# Altium project QUTMS_PDM_V2.PrjPcb
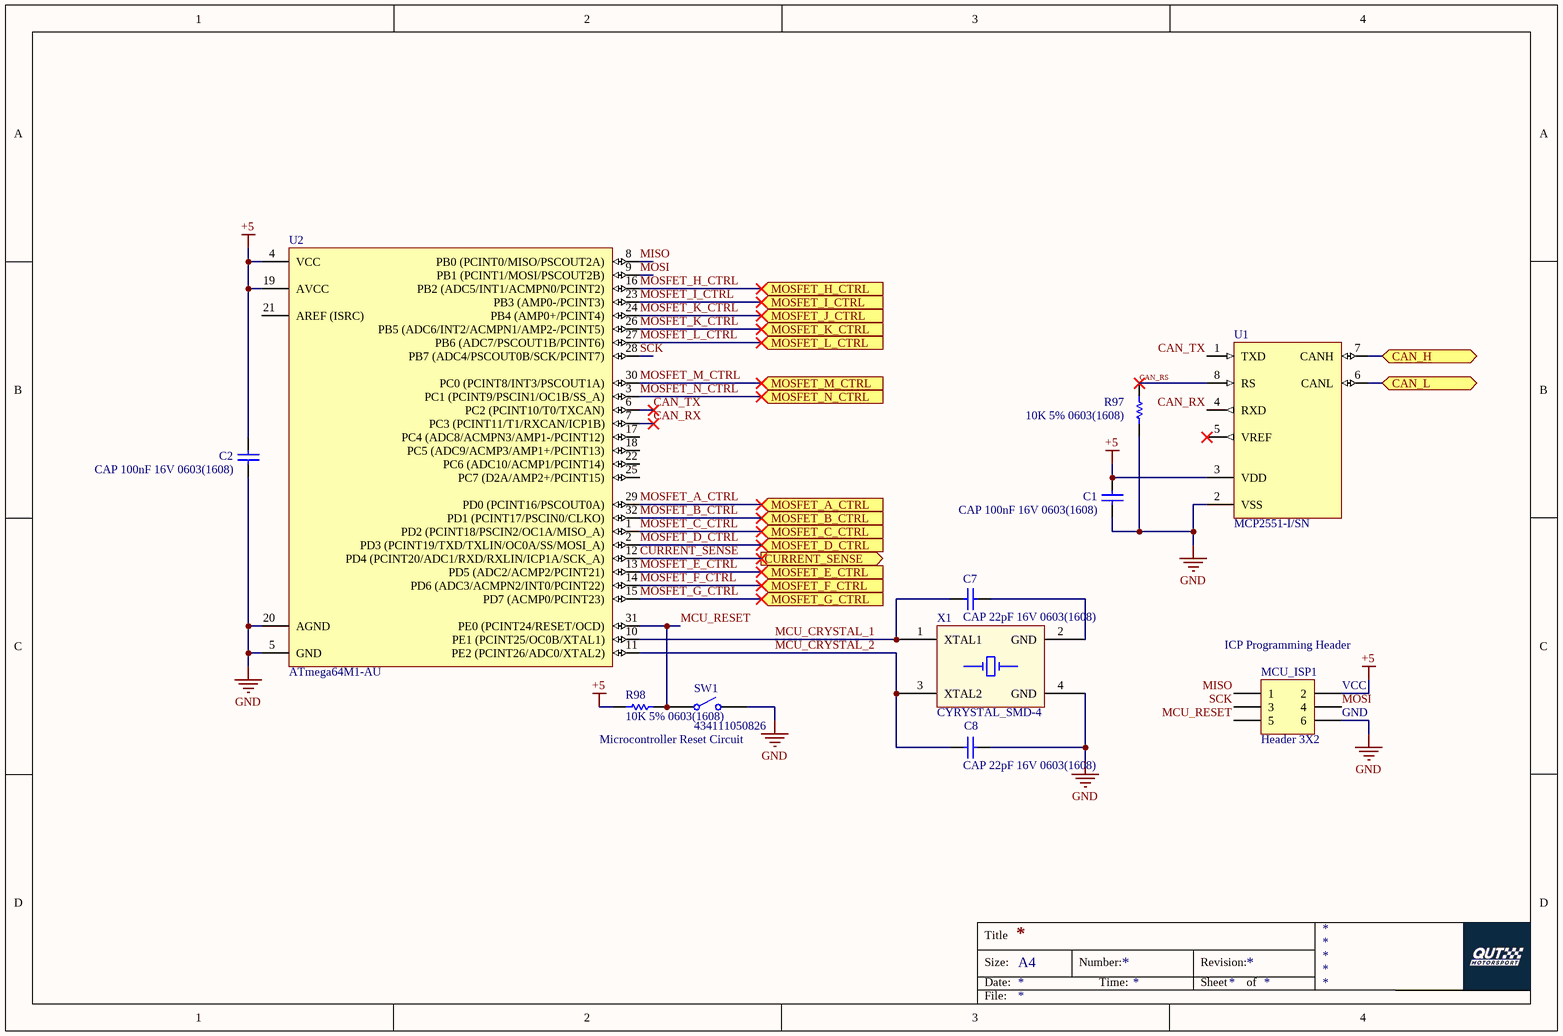
[diagram p0: MCU.SchDoc]
5 sheets, 96 parts. Net scope: flat (ports and power ports of the same name join across sheets).
Board file: Board.PcbDoc
Sheets:
  MCU.SchDoc
  ConnectorIn.SchDoc
  ConnectorOut.SchDoc
  PowerSupply.SchDoc
  MOSFETs.SchDoc

## Sheet MCU.SchDoc
size A4

### Parts
C1  CAP 100nF 16V 0603(1608)  [CAPC0603(1608)100_M]
C2  CAP 100nF 16V 0603(1608)  [CAPC0603(1608)100_M]
C7  CAP 22pF 16V 0603(1608)  [CAPC0603(1608)100_N]
C8  CAP 22pF 16V 0603(1608)  [CAPC0603(1608)100_N]
MCU_ISP1  Header 3X2  [HDR2X3]
R97  10K 5% 0603(1608)  [RESC0603(1608)_N]
R98  10K 5% 0603(1608)  [RESC0603(1608)_N]
SW1  434111050826  [434111050826]
U1  MCP2551-I/SN  [SOIC-SN8_N]
U2  ATmega64M1-AU  [32A_L]
X1  CYRYSTAL_SMD-4  [SMD-4_CRYSTAL_5x3.2mm]

### Ports
CAN_H (bidir), CAN_L (bidir), CURRENT_SENSE (out), MOSFET_A_CTRL (in), MOSFET_B_CTRL (in), MOSFET_C_CTRL (in), MOSFET_D_CTRL (in), MOSFET_E_CTRL (in), MOSFET_F_CTRL (in), MOSFET_G_CTRL (in), MOSFET_H_CTRL (in), MOSFET_I_CTRL (in), MOSFET_J_CTRL (in), MOSFET_K_CTRL (in), MOSFET_L_CTRL (in), MOSFET_M_CTRL (in), MOSFET_N_CTRL (in)

### Nets
+5: C1.2 C2.2 MCU_ISP1.2 R98.2 U1.3(VDD) U2.4(VCC) U2.19(AVCC)
GND: C1.1 C2.1 C8.2 MCU_ISP1.6 R97.1 SW1.2 U1.2(VSS) U2.5(GND) U2.20(AGND) X1.4(GND)
CAN_RS: R97.2 U1.8(RS)
CAN_RX: U1.4(RXD) U2.7(PC3_(PCINT11/T1/RXCAN/ICP1B))
CAN_TX: U1.1(TXD) U2.6(PC2_(PCINT10/T0/TXCAN))
CURRENT_SENSE: U2.12(PD4_(PCINT20/ADC1/RXD/RXLIN/ICP1A/SCK_A)) ; port CURRENT_SENSE
MCU_CRYSTAL_1: C7.1 U2.10(PE1_(PCINT25/OC0B/XTAL1)) X1.1(XTAL1)
MCU_CRYSTAL_2: C8.1 U2.11(PE2_(PCINT26/ADC0/XTAL2)) X1.3(XTAL2)
MCU_RESET: MCU_ISP1.5 R98.1 SW1.1 U2.31(PE0_(PCINT24/RESET/OCD))
MISO: MCU_ISP1.1 U2.8(PB0_(PCINT0/MISO/PSCOUT2A))
MOSFET_A_CTRL: U2.29(PD0_(PCINT16/PSCOUT0A)) ; port MOSFET_A_CTRL
MOSFET_B_CTRL: U2.32(PD1_(PCINT17/PSCIN0/CLKO)) ; port MOSFET_B_CTRL
MOSFET_C_CTRL: U2.1(PD2_(PCINT18/PSCIN2/OC1A/MISO_A)) ; port MOSFET_C_CTRL
MOSFET_D_CTRL: U2.2(PD3_(PCINT19/TXD/TXLIN/OC0A/SS/MOSI_A)) ; port MOSFET_D_CTRL
MOSFET_E_CTRL: U2.13(PD5_(ADC2/ACMP2/PCINT21)) ; port MOSFET_E_CTRL
MOSFET_F_CTRL: U2.14(PD6_(ADC3/ACMPN2/INT0/PCINT22)) ; port MOSFET_F_CTRL
MOSFET_G_CTRL: U2.15(PD7_(ACMP0/PCINT23)) ; port MOSFET_G_CTRL
MOSFET_H_CTRL: U2.16(PB2_(ADC5/INT1/ACMPN0/PCINT2)) ; port MOSFET_H_CTRL
MOSFET_I_CTRL: U2.23(PB3_(AMP0-/PCINT3)) ; port MOSFET_I_CTRL
MOSFET_K_CTRL: U2.24(PB4_(AMP0+/PCINT4)) U2.26(PB5_(ADC6/INT2/ACMPN1/AMP2-/PCINT5)) ; port MOSFET_J_CTRL, port MOSFET_K_CTRL
MOSFET_L_CTRL: U2.27(PB6_(ADC7/PSCOUT1B/PCINT6)) ; port MOSFET_L_CTRL
MOSFET_M_CTRL: U2.30(PC0_(PCINT8/INT3/PSCOUT1A)) ; port MOSFET_M_CTRL
MOSFET_N_CTRL: U2.3(PC1_(PCINT9/PSCIN1/OC1B/SS_A)) ; port MOSFET_N_CTRL
MOSI: MCU_ISP1.4 U2.9(PB1_(PCINT1/MOSI/PSCOUT2B))
SCK: MCU_ISP1.3 U2.28(PB7_(ADC4/PSCOUT0B/SCK/PCINT7))
NetC7_2: C7.2 X1.2(GND)
NetJ1_2: U1.6(CANL) ; port CAN_L
NetJ1_3: U1.7(CANH) ; port CAN_H

Not connected (* = marked no-connect by the designer): U1 5(VREF)*; U2 17(PC4_(ADC8/ACMPN3/AMP1-/PCINT12)) 18(PC5_(ADC9/ACMP3/AMP1+/PCINT13)) 21(AREF_(ISRC)) 22(PC6_(ADC10/ACMP1/PCINT14)) 25(PC7_(D2A/AMP2+/PCINT15))

### Notes on the sheet
- (near MCU_ISP1) ICP Programming Header
- (near MCU_ISP1) VCC
- (near MCU_ISP1) GND
- Microcontroller Reset Circuit
- Title
- Size:
- Date:
- A4
- Number:
- Time:
- Revision:
- Sheet
- of
- File:

### Library data of the parts
C1 C2 = CMP-1035-02583-1: CAP 100nF 16V ±5% 0603 (1608 Metric) Thickness 1mm SMD; Tolerance: Â±5%; Case-Metric: 1608; Case-EIA: 0603; Rated Voltage: 16 V; Max Thickness: 1 mm; Technology: SMT; Value: 100nF
C7 C8 = CMP-1035-00808-1: CAP 22pF 16V ±5% 0603 (1608 Metric) Thickness 1mm SMD; Tolerance: Â±5%; Case-EIA: 0603; Case-Metric: 1608; Technology: SMT; Value: 22pF; Rated Voltage: 16 V; Max Thickness: 1 mm
MCU_ISP1 = Header 3X2: Header, 3-Pin, Dual row; LatestRevisionDate: 17-Jul-2002; LatestRevisionNote: Re-released for DXP Platform.; Publisher: Altium Limited
R97 R98 = CMP-1012-00098-1: 10K 0.1W 5% 0603 (1608 Metric)  SMD; Case-EIA: 0603; Value: 10000.00 Ohm; Case-Metric: 1608; Technology: SMT; Tolerance: 5 %; Power: 0.1 W
SW1 = CMP-1459-00003-1: WS-TASV SMD Tact Switch 6.0X3.5 mm; Manufacturer: Wuerth Elektronik; NoPins: 02; ComponentLink2URL: http://katalog.we-online.de/em/datasheet/434111050826.pdf; PackageReference: 434111050826; ComponentLink2Description: Datasheet; PartNumber: 434111050826; ComponentLink1URL: http://www.we-online.com; ComponentLink1Description: Manufacturer URL
U1 = CMP-0186-00138-2: High-Speed CAN Transceiver, 8-Pin SOIC, Industrial Temperature; Code_JEDEC: MS-012; ComponentLink3URL: http://www.microchip.com/stellent/groups/techpub_sg/documents/packagingspec/en012702.pdf; DatasheetVersion: revF, Jul-2010; PackageVersion: revBB, Aug-2009; PackageDescription: 8-Lead Plastic Small Outline (SN) - Narrow, 3.90mm Body [SOIC]; ComponentLink1URL: http://www.microchip.com/; ComponentLink3Description: Package Specification; ComponentLink2Description: Datasheet; Code_IPC: SOIC127P600-8; ComponentLink1Description: Manufacturer URL; PackageReference: SOIC-SN8; ComponentLink2URL: http://ww1.microchip.com/downloads/en/DeviceDoc/21667F.pdf; RevisionNote: URLs added. DatasheetVersion updated.
U2 = CMP-0096-00131-2: 8-bit AVR Microcontroller, 2.7-5.5V, 16MHz, 64KB Flash, 2KB EEPROM, 4KB SRAM, Industrial Grade (-40° to +85°C), 32-Pin TQFP; Code_JEDEC: MS-026-ABA; PackageVersion: revC, Oct-2010; ComponentLink2Description: ATmega16M1/32M1/64M1 Datasheet; ComponentLink1Description: Manufacturer URL; DatasheetVersion: revD, Nov-2010; ComponentLink3Description: ATmega16M1/32M1/64M1 Summary; ComponentLink1URL: http://www.atmel.com/; RevisionNote: DatasheetVersion & PackageVersion updated. URLs added.; PackageReference: 32A; ComponentLink3URL: http://www.atmel.com/dyn/resources/prod_documents/8209S.pdf; PackageDescription: 32-Lead, 7x7x1.0 mm Body, 0.8mm Lead Pitch, Thin Profile Plastic Quad Flat Package (TQFP); ComponentLink2URL: http://www.atmel.com/dyn/resources/prod_documents/doc8209.pdf

## Sheet ConnectorIn.SchDoc
size A4
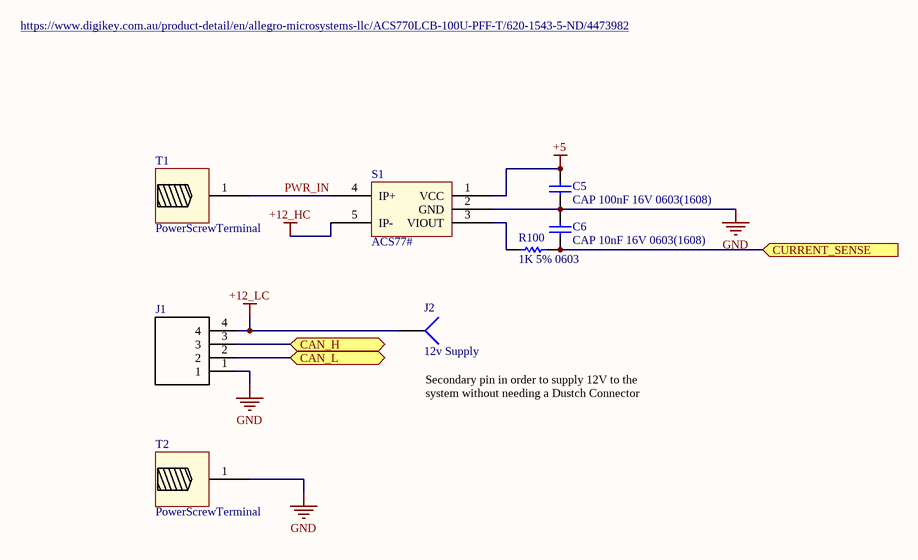
[diagram p1: ConnectorIn.SchDoc]

### Parts
C5  CAP 100nF 16V 0603(1608)  [CAPC0603(1608)100_M]
C6  CAP 10nF 16V 0603(1608)  [CAPC0603(1608)100_M]
J1  DT15-4P  [TE_DT15-4P]  (value not drawn)
J2  12v Supply  [PIN1]
R100  1K 5% 0603  [RESC0603(1608)_L]
S1  ACS77#  [ACS77#]
T1  PowerScrewTerminal  [WE_REDCUBE_74650195R]
T2  PowerScrewTerminal  [WE_REDCUBE_74650195R]

### Ports
CAN_H (bidir), CAN_L (bidir), CURRENT_SENSE (in)

### Nets
+5: C5.2 S1.1(VCC)
+12_HC: S1.5(IP-)
+12_LC: J1.4 J2.1
GND: C5.1 C6.2 J1.1 S1.2(GND) T2.1
CURRENT_SENSE: C6.1 R100.1 ; port CURRENT_SENSE
PWR_IN: S1.4(IP+) T1.1
NetJ1_2: J1.2 ; port CAN_L
NetJ1_3: J1.3 ; port CAN_H
NetR100_2: R100.2 S1.3(VIOUT)

### Notes on the sheet
- https://www.digikey.com.au/product-detail/en/allegro-microsystems-llc/ACS770LCB-100U-PFF-T/620-1543-5-ND/4473982
- (near J2) Secondary pin in order to supply 12V to the system without needing a Dustch Connector
- Title
- Size:
- Date:
- A4
- Number:
- Time:
- Revision:
- Sheet
- of
- File:

### Library data of the parts
C5 = CMP-1035-02583-1: as C1 on sheet MCU; Rated Voltage: 16 V; Max Thickness: 1 mm; Technology: SMT; Value: 100nF
C6 = CMP-1035-02310-1: CAP 10nF 16V ±5% 0603 (1608 Metric) Thickness 1mm SMD; Case-Metric: 1608; Case-EIA: 0603; Tolerance: Â±5%; Technology: SMT; Value: 10nF; Rated Voltage: 16 V; Max Thickness: 1 mm
J1 = DT15-4P: DT Series 4 Position 16 AWG Flange Mount Male Pin Through Hole Receptacle Header; MF: TE Connectivity; Package: None; Digi-Key_Purchase_URL: https://www.digikey.com/product-detail/en/te-connectivity-deutsch-connectors/DT15-4P/1734-1030-ND/6566594?utm_source=snapeda&utm_medium=aggregator&utm_campaign=symbol; MP: DT15-4P; TE_purchase_URL: https://www.te.com/usa-en/product-DT15-4P.html?te_bu=Cor&te_type=disp&te_campaign=seda_glo_cor-seda-global-disp-prtnr-fy19-seda-model-bom-cta_sma-317_1&elqCampaignId=32493; Digi-Key_Part_Number: 1734-1030-ND; SnapEDA_Link: https://www.snapeda.com/parts/DT15-4P/TE%20Connectivity%20Deutsch%20Connectors/view-part/?ref=snap; Value: *
J2 = Socket: LatestRevisionDate: 17-Jul-2002; LatestRevisionNote: Re-released for DXP Platform.; Publisher: Altium Limited
R100 = CMP-1012-00074-1: 1K 0.1W 5% 0603 (1608 Metric)  SMD; Case-EIA: 0603; Case-Metric: 1608; Value: 1000.00 Ohm; Technology: SMT; Tolerance: 5 %; Power: 0.1 W

## Sheet ConnectorOut.SchDoc
size A4
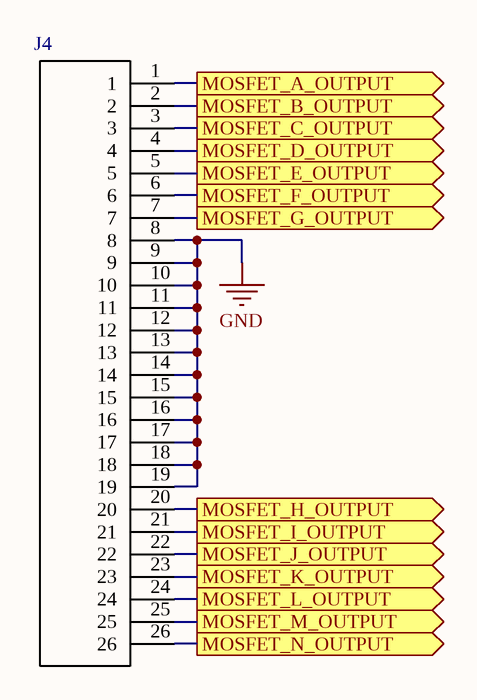
[diagram p2: ConnectorOut.SchDoc]

### Parts
J4  6473418-1  [TE_6473418-1]  (value not drawn)

### Ports
MOSFET_A_OUTPUT (out), MOSFET_B_OUTPUT (out), MOSFET_C_OUTPUT (out), MOSFET_D_OUTPUT (out), MOSFET_E_OUTPUT (out), MOSFET_F_OUTPUT (out), MOSFET_G_OUTPUT (out), MOSFET_H_OUTPUT (out), MOSFET_I_OUTPUT (out), MOSFET_J_OUTPUT (out), MOSFET_K_OUTPUT (out), MOSFET_L_OUTPUT (out), MOSFET_M_OUTPUT (out), MOSFET_N_OUTPUT (out)

### Nets
GND: J4.8 J4.9 J4.10 J4.11 J4.12 J4.13 J4.14 J4.15 J4.16 J4.17 J4.18 J4.19
NetJ4_1: J4.1 ; port MOSFET_A_OUTPUT
NetJ4_2: J4.2 ; port MOSFET_B_OUTPUT
NetJ4_3: J4.3 ; port MOSFET_C_OUTPUT
NetJ4_4: J4.4 ; port MOSFET_D_OUTPUT
NetJ4_5: J4.5 ; port MOSFET_E_OUTPUT
NetJ4_6: J4.6 ; port MOSFET_F_OUTPUT
NetJ4_7: J4.7 ; port MOSFET_G_OUTPUT
NetJ4_20: J4.20 ; port MOSFET_H_OUTPUT
NetJ4_21: J4.21 ; port MOSFET_I_OUTPUT
NetJ4_22: J4.22 ; port MOSFET_J_OUTPUT
NetJ4_23: J4.23 ; port MOSFET_K_OUTPUT
NetJ4_24: J4.24 ; port MOSFET_L_OUTPUT
NetJ4_25: J4.25 ; port MOSFET_M_OUTPUT
NetJ4_26: J4.26 ; port MOSFET_N_OUTPUT

### Notes on the sheet
- Title
- Size:
- Date:
- A4
- Number:
- Time:
- Revision:
- Sheet
- of
- File:

### Library data of the parts
J4 = 6473418-1: Conn Shrouded Header PIN 26 POS 3mm Solder ST Thru-Hole Automotive Tube; MF: TE Connectivity; Package: None; Digi-Key_Purchase_URL: https://www.digikey.com/product-detail/en/te-connectivity-amp-connectors/6473418-1/A121634-ND/2329277?utm_source=snapeda&utm_medium=aggregator&utm_campaign=symbol; MP: 6473418-1; TE_purchase_URL: https://www.te.com/usa-en/product-6473418-1.html?te_bu=Cor&te_type=disp&te_campaign=seda_glo_cor-seda-global-disp-prtnr-fy19-seda-model-bom-cta_sma-317_1&elqCampaignId=32493; EU_RoHS_Compliance: Compliant; Digi-Key_Part_Number: A121634-ND; SnapEDA_Link: https://www.snapeda.com/parts/6473418-1/TE%20Connectivity%20AMP%20Connectors/view-part/?ref=snap; Value: *

## Sheet PowerSupply.SchDoc
size A4
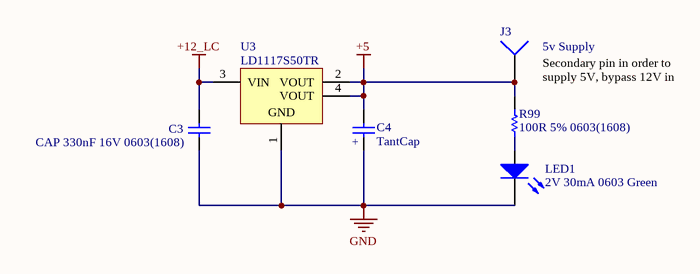
[diagram p3: PowerSupply.SchDoc]

### Parts
C3  CAP 330nF 16V 0603(1608)  [CAPC0603(1608)100_M]
C4  TantCap  [TantCap_2917 (7343)]
J3  5v Supply  [PIN1]
LED1  2V 30mA 0603 Green  [0603_A]
R99  100R 5% 0603(1608)  [RESC0603(1608)_L]
U3  LD1117S50TR  [SOT-223_L]

### Nets
+5: C4.2 J3.1 R99.1 U3.2(VOUT) U3.4(VOUT)
+12_LC: C3.2 U3.3(VIN)
GND: C3.1 C4.1 LED1.1(K) U3.1(GND)
NetLED1_2: LED1.2(A) R99.2

### Notes on the sheet
- Secondary pin in order to supply 5V, bypass 12V in
- Title
- Size:
- Date:
- A4
- Number:
- Time:
- Revision:
- Sheet
- of
- File:
- (in symbol TantCap) +

### Library data of the parts
C3 = CMP-1035-02670-1: CAP 330nF 16V ±5% 0603 (1608 Metric) Thickness 1mm SMD; Case-Metric: 1608; Tolerance: Â±5%; Case-EIA: 0603; Rated Voltage: 16 V; Max Thickness: 1 mm; Value: 330nF; Technology: SMT
J3 = Socket: LatestRevisionDate: 17-Jul-2002; LatestRevisionNote: Re-released for DXP Platform.; Publisher: Altium Limited
LED1 = CMP-1426-00006-1: SMD mono-color Chip LED, WL-SMCW, Bright Green; PartNumber: 150060VS75000; Manufacturer: Wuerth Elektronik; ComponentLink2URL: http://katalog.we-online.com/led/datasheet/150060VS75000.pdf; ComponentLink1Description: Manufacturer URL; PackageReference: 0603_A; ComponentLink2Description: Datasheet; ComponentLink1URL: http://www.we-online.com; Color: Bright Green
R99 = CMP-1012-00050-1: 100R 0.1W 5% 0603 (1608 Metric)  SMD; Case-EIA: 0603; Value: 100.00 Ohm; Case-Metric: 1608; Tolerance: 5 %; Technology: SMT; Power: 0.1 W
U3 = CMP-0244-00312-1: Fixed Low Drop Positive Voltage Regulator, 5V, 4-Pin SOT-223, Tape and Reel; ComponentLink1URL: http://www.st.com; DatasheetVersion: 1/11/2011; PackageDescription: 4-Pin SOT-223 Package, 6.5 x 3.5 mm Body, 2.3 mm Pitch, 7 mm Lead Span; ComponentLink2URL: http://www.st.com/internet/com/TECHNICAL_RESOURCES/TECHNICAL_LITERATURE/DATASHEET/CD00000544.pdf; ComponentLink1Description: Manufacturer URL; PackageReference: SOT-223; PackageVersion: 2010; ComponentLink2Description: Datasheet

## Sheet MOSFETs.SchDoc
size A3
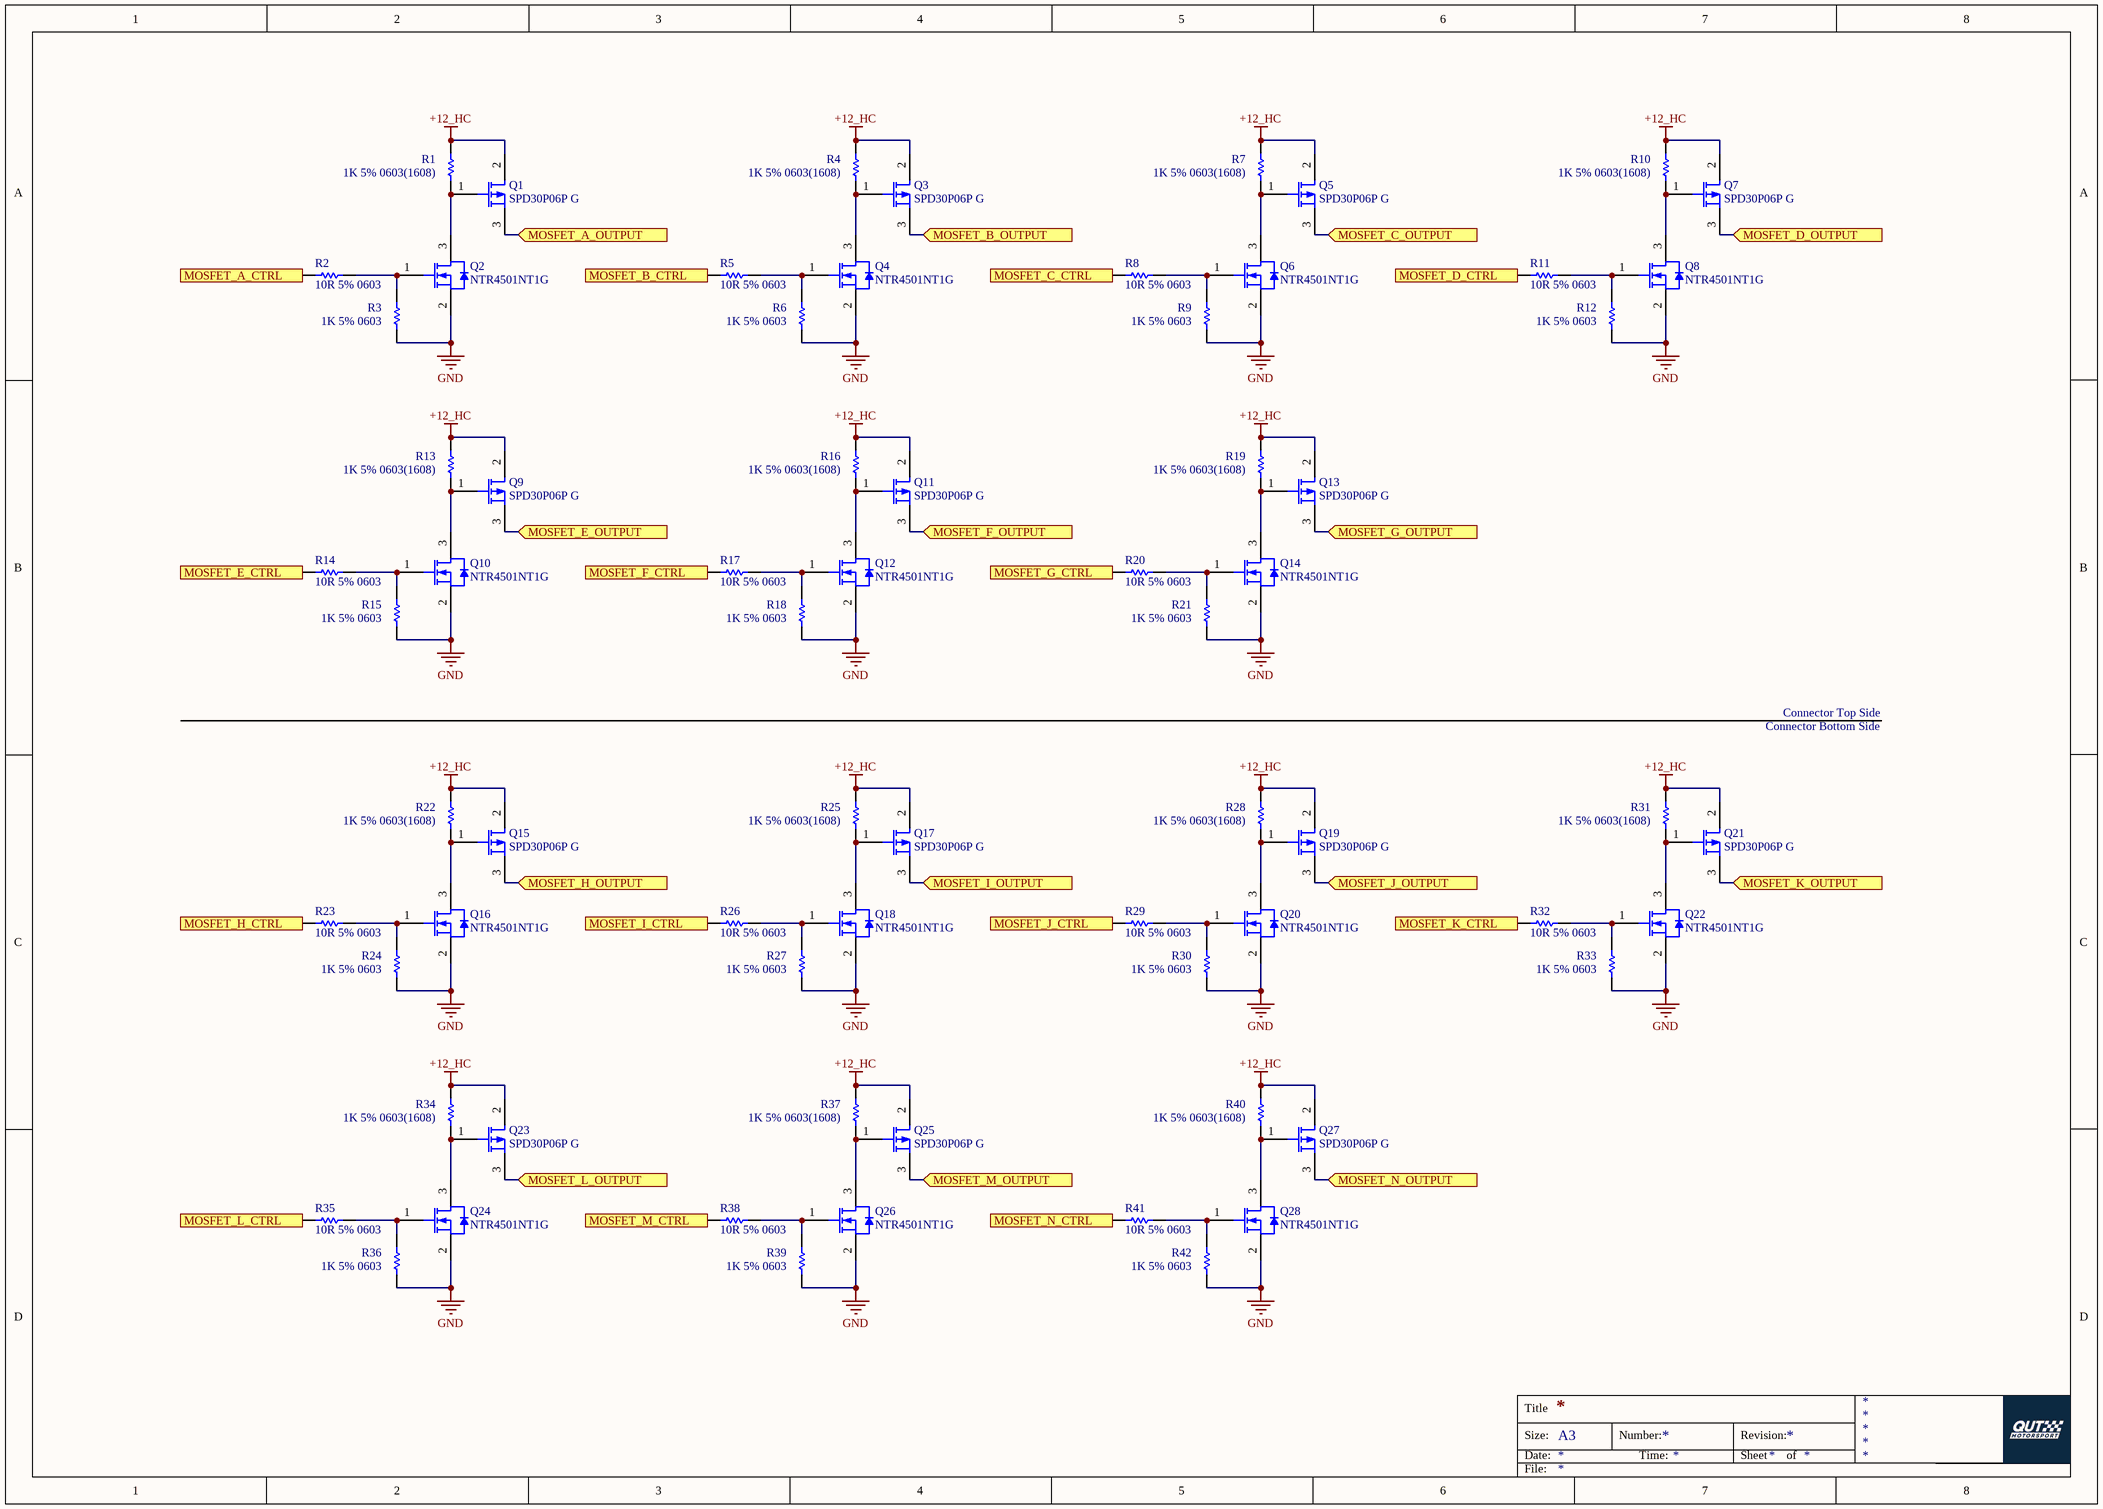
[diagram p4: MOSFETs.SchDoc]

### Parts
Q1  SPD30P06P G  [INF-PG-TO252-3-1_N]
Q2  NTR4501NT1G  [ONSC-SOT-23-3-318-08_V]
Q3  SPD30P06P G  [INF-PG-TO252-3-1_N]
Q4  NTR4501NT1G  [ONSC-SOT-23-3-318-08_V]
Q5  SPD30P06P G  [INF-PG-TO252-3-1_N]
Q6  NTR4501NT1G  [ONSC-SOT-23-3-318-08_V]
Q7  SPD30P06P G  [INF-PG-TO252-3-1_N]
Q8  NTR4501NT1G  [ONSC-SOT-23-3-318-08_V]
Q9  SPD30P06P G  [INF-PG-TO252-3-1_N]
Q10  NTR4501NT1G  [ONSC-SOT-23-3-318-08_V]
Q11  SPD30P06P G  [INF-PG-TO252-3-1_N]
Q12  NTR4501NT1G  [ONSC-SOT-23-3-318-08_V]
Q13  SPD30P06P G  [INF-PG-TO252-3-1_N]
Q14  NTR4501NT1G  [ONSC-SOT-23-3-318-08_V]
Q15  SPD30P06P G  [INF-PG-TO252-3-1_N]
Q16  NTR4501NT1G  [ONSC-SOT-23-3-318-08_V]
Q17  SPD30P06P G  [INF-PG-TO252-3-1_N]
Q18  NTR4501NT1G  [ONSC-SOT-23-3-318-08_V]
Q19  SPD30P06P G  [INF-PG-TO252-3-1_N]
Q20  NTR4501NT1G  [ONSC-SOT-23-3-318-08_V]
Q21  SPD30P06P G  [INF-PG-TO252-3-1_N]
Q22  NTR4501NT1G  [ONSC-SOT-23-3-318-08_V]
Q23  SPD30P06P G  [INF-PG-TO252-3-1_N]
Q24  NTR4501NT1G  [ONSC-SOT-23-3-318-08_V]
Q25  SPD30P06P G  [INF-PG-TO252-3-1_N]
Q26  NTR4501NT1G  [ONSC-SOT-23-3-318-08_V]
Q27  SPD30P06P G  [INF-PG-TO252-3-1_N]
Q28  NTR4501NT1G  [ONSC-SOT-23-3-318-08_V]
R1  1K 5% 0603(1608)  [RESC0603(1608)_L]
R2  10R 5% 0603  [RESC0603(1608)_L]
R3  1K 5% 0603  [RESC0603(1608)_L]
R4  1K 5% 0603(1608)  [RESC0603(1608)_L]
R5  10R 5% 0603  [RESC0603(1608)_L]
R6  1K 5% 0603  [RESC0603(1608)_L]
R7  1K 5% 0603(1608)  [RESC0603(1608)_L]
R8  10R 5% 0603  [RESC0603(1608)_L]
R9  1K 5% 0603  [RESC0603(1608)_L]
R10  1K 5% 0603(1608)  [RESC0603(1608)_L]
R11  10R 5% 0603  [RESC0603(1608)_L]
R12  1K 5% 0603  [RESC0603(1608)_L]
R13  1K 5% 0603(1608)  [RESC0603(1608)_L]
R14  10R 5% 0603  [RESC0603(1608)_L]
R15  1K 5% 0603  [RESC0603(1608)_L]
R16  1K 5% 0603(1608)  [RESC0603(1608)_L]
R17  10R 5% 0603  [RESC0603(1608)_L]
R18  1K 5% 0603  [RESC0603(1608)_L]
R19  1K 5% 0603(1608)  [RESC0603(1608)_L]
R20  10R 5% 0603  [RESC0603(1608)_L]
R21  1K 5% 0603  [RESC0603(1608)_L]
R22  1K 5% 0603(1608)  [RESC0603(1608)_L]
R23  10R 5% 0603  [RESC0603(1608)_L]
R24  1K 5% 0603  [RESC0603(1608)_L]
R25  1K 5% 0603(1608)  [RESC0603(1608)_L]
R26  10R 5% 0603  [RESC0603(1608)_L]
R27  1K 5% 0603  [RESC0603(1608)_L]
R28  1K 5% 0603(1608)  [RESC0603(1608)_L]
R29  10R 5% 0603  [RESC0603(1608)_L]
R30  1K 5% 0603  [RESC0603(1608)_L]
R31  1K 5% 0603(1608)  [RESC0603(1608)_L]
R32  10R 5% 0603  [RESC0603(1608)_L]
R33  1K 5% 0603  [RESC0603(1608)_L]
R34  1K 5% 0603(1608)  [RESC0603(1608)_L]
R35  10R 5% 0603  [RESC0603(1608)_L]
R36  1K 5% 0603  [RESC0603(1608)_L]
R37  1K 5% 0603(1608)  [RESC0603(1608)_L]
R38  10R 5% 0603  [RESC0603(1608)_L]
R39  1K 5% 0603  [RESC0603(1608)_L]
R40  1K 5% 0603(1608)  [RESC0603(1608)_L]
R41  10R 5% 0603  [RESC0603(1608)_L]
R42  1K 5% 0603  [RESC0603(1608)_L]

### Ports
MOSFET_A_CTRL (out), MOSFET_A_OUTPUT (in), MOSFET_B_CTRL (out), MOSFET_B_OUTPUT (in), MOSFET_C_CTRL (out), MOSFET_C_OUTPUT (in), MOSFET_D_CTRL (out), MOSFET_D_OUTPUT (in), MOSFET_E_CTRL (out), MOSFET_E_OUTPUT (in), MOSFET_F_CTRL (out), MOSFET_F_OUTPUT (in), MOSFET_G_CTRL (out), MOSFET_G_OUTPUT (in), MOSFET_H_CTRL (out), MOSFET_H_OUTPUT (in), MOSFET_I_CTRL (out), MOSFET_I_OUTPUT (in), MOSFET_J_CTRL (out), MOSFET_J_OUTPUT (in), MOSFET_K_CTRL (out), MOSFET_K_OUTPUT (in), MOSFET_L_CTRL (out), MOSFET_L_OUTPUT (in), MOSFET_M_CTRL (out), MOSFET_M_OUTPUT (in), MOSFET_N_CTRL (out), MOSFET_N_OUTPUT (in)

### Nets
+12_HC: Q1.2(D) Q3.2(D) Q5.2(D) Q7.2(D) Q9.2(D) Q11.2(D) Q13.2(D) Q15.2(D) Q17.2(D) Q19.2(D) Q21.2(D) Q23.2(D) Q25.2(D) Q27.2(D) R1.2 R4.2 R7.2 R10.2 R13.2 R16.2 R19.2 R22.2 R25.2 R28.2 R31.2 R34.2 R37.2 R40.2
GND: Q2.2(S) Q4.2(S) Q6.2(S) Q8.2(S) Q10.2(S) Q12.2(S) Q14.2(S) Q16.2(S) Q18.2(S) Q20.2(S) Q22.2(S) Q24.2(S) Q26.2(S) Q28.2(S) R3.1 R6.1 R9.1 R12.1 R15.1 R18.1 R21.1 R24.1 R27.1 R30.1 R33.1 R36.1 R39.1 R42.1
MOSFET_A_CTRL: R2.2 ; port MOSFET_A_CTRL
MOSFET_B_CTRL: R5.2 ; port MOSFET_B_CTRL
MOSFET_C_CTRL: R8.2 ; port MOSFET_C_CTRL
MOSFET_D_CTRL: R11.2 ; port MOSFET_D_CTRL
MOSFET_E_CTRL: R14.2 ; port MOSFET_E_CTRL
MOSFET_F_CTRL: R17.2 ; port MOSFET_F_CTRL
MOSFET_G_CTRL: R20.2 ; port MOSFET_G_CTRL
MOSFET_H_CTRL: R23.2 ; port MOSFET_H_CTRL
MOSFET_I_CTRL: R26.2 ; port MOSFET_I_CTRL
MOSFET_K_CTRL: R29.2 R32.2 ; port MOSFET_J_CTRL, port MOSFET_K_CTRL
MOSFET_L_CTRL: R35.2 ; port MOSFET_L_CTRL
MOSFET_M_CTRL: R38.2 ; port MOSFET_M_CTRL
MOSFET_N_CTRL: R41.2 ; port MOSFET_N_CTRL
NetJ4_1: Q1.3(S) ; port MOSFET_A_OUTPUT
NetJ4_2: Q3.3(S) ; port MOSFET_B_OUTPUT
NetJ4_3: Q5.3(S) ; port MOSFET_C_OUTPUT
NetJ4_4: Q7.3(S) ; port MOSFET_D_OUTPUT
NetJ4_5: Q9.3(S) ; port MOSFET_E_OUTPUT
NetJ4_6: Q11.3(S) ; port MOSFET_F_OUTPUT
NetJ4_7: Q13.3(S) ; port MOSFET_G_OUTPUT
NetJ4_20: Q15.3(S) ; port MOSFET_H_OUTPUT
NetJ4_21: Q17.3(S) ; port MOSFET_I_OUTPUT
NetJ4_22: Q19.3(S) ; port MOSFET_J_OUTPUT
NetJ4_23: Q21.3(S) ; port MOSFET_K_OUTPUT
NetJ4_24: Q23.3(S) ; port MOSFET_L_OUTPUT
NetJ4_25: Q25.3(S) ; port MOSFET_M_OUTPUT
NetJ4_26: Q27.3(S) ; port MOSFET_N_OUTPUT
NetQ1_1: Q1.1(G) Q2.3(D) R1.1
NetQ2_1: Q2.1(G) R2.1 R3.2
NetQ3_1: Q3.1(G) Q4.3(D) R4.1
NetQ4_1: Q4.1(G) R5.1 R6.2
NetQ5_1: Q5.1(G) Q6.3(D) R7.1
NetQ6_1: Q6.1(G) R8.1 R9.2
NetQ7_1: Q7.1(G) Q8.3(D) R10.1
NetQ8_1: Q8.1(G) R11.1 R12.2
NetQ9_1: Q9.1(G) Q10.3(D) R13.1
NetQ10_1: Q10.1(G) R14.1 R15.2
NetQ11_1: Q11.1(G) Q12.3(D) R16.1
NetQ12_1: Q12.1(G) R17.1 R18.2
NetQ13_1: Q13.1(G) Q14.3(D) R19.1
NetQ14_1: Q14.1(G) R20.1 R21.2
NetQ15_1: Q15.1(G) Q16.3(D) R22.1
NetQ16_1: Q16.1(G) R23.1 R24.2
NetQ17_1: Q17.1(G) Q18.3(D) R25.1
NetQ18_1: Q18.1(G) R26.1 R27.2
NetQ19_1: Q19.1(G) Q20.3(D) R28.1
NetQ20_1: Q20.1(G) R29.1 R30.2
NetQ21_1: Q21.1(G) Q22.3(D) R31.1
NetQ22_1: Q22.1(G) R32.1 R33.2
NetQ23_1: Q23.1(G) Q24.3(D) R34.1
NetQ24_1: Q24.1(G) R35.1 R36.2
NetQ25_1: Q25.1(G) Q26.3(D) R37.1
NetQ26_1: Q26.1(G) R38.1 R39.2
NetQ27_1: Q27.1(G) Q28.3(D) R40.1
NetQ28_1: Q28.1(G) R41.1 R42.2

### Notes on the sheet
- Connector Top Side
- Connector Bottom Side
- Title
- Size:
- Date:
- A3
- Number:
- Time:
- Revision:
- Sheet
- of
- File:

### Library data of the parts
Q1 Q3 Q5 Q7 Q9 Q11 Q13 Q15 Q17 Q19 Q21 Q23 Q25 Q27 = CMP-1099-00058-1: P-Channel SIPMOS Power-Transistor, -60 V VDS, -30 A ID, -55 to 175 degC, PG-TO252-3-1, Reel, Green; Manufacturer: Infineon; Pto t (max): 125Â W; RDS (on) (max): 75Â mOhm; VGS(th) (max): -4Â V; Green: TRUE; ID (max): -30Â A; QG: 32Â nC; VDS (max): -60Â V; VGS(th) (min): -2.1Â V; RthJC (max): 1.2Â K/W; IDpuls (max): -120Â A; ComponentLink1Description: Manufacturer URL; Packing: Reel; ComponentLink2Description: Datasheet; ComponentLink1URL: http://www.infineon.com/; ComponentLink3Description: Package Specification; PackageDescription: 3-Pin Plastic (Green) Transistor Single Outline Package, 6.5 x 6.12 mm Body, 2.28 mm Pitch; Mounting Technology: Surface Mount; ComponentLink3URL: http://www.infineon.com/dgdl/TLE42744_DS_11.pdf?folderId=db3a304318f3fe290118f5a433570040&fileId=db3a304327b897500128012ccafe37d2&sId=db3a30443d67b5ca013d83f7c0ea327b; Rth: 1.2Â K/W; ComponentLink2URL: http://www.infineon.com/dgdl/SPD30P06P_Rev.2.3_pdf.pdf?folderId=db3a30431ed1d7b2011f4042f2ff4ec5&fileId=db3a30431ed1d7b2011f404fbc7e4ef4; PartNumber: SPD30P06P G; PackageReference: PG-TO252-3-1; DatasheetVersion: Rev. 2.3; PackageVersion: Jan-10
Q2 Q4 Q6 Q8 Q10 Q12 Q14 Q16 Q18 Q20 Q22 Q24 Q26 Q28 = CMP-1058-00732-1: Power MOSFET, 20 V, 3.2 A, Single N-Channel, 3-Pin SOT-23, Pb-Free, Tape and Reel; Manufacturer: On Semiconductor; VGS Max (V): 12; VGS(th) Max (V): 1.2; PD Max (W): 1.25; Coss Typ (pF): 80; Ciss Typ (pF): 200; V(BR)DSS Min (V): 20; Qrr Typ (nC): 3; Crss Typ (pF): 50; Channel Polarity: N Channel; RoHS: Pb-Free; ComponentLink3URL: http://www.onsemi.cn/pub_link/Collateral/318-08.PDF; ComponentLink2Description: Datasheet; PackageVersion: Rev. AP, 11/2009; Mounting Technology: Surface Mount; PackageDescription: 3-Pin Small Outline Transistor, Body 2.92 x 1.3 mm, Pitch 0.95 mm; PackageReference: SOT-23-3-318-08; ComponentLink1URL: http://www.onsemi.com/; Packing: Tape and Reel; Configuration: Single; ComponentLink2URL: http://www.onsemi.cn/pub_link/Collateral/NTR4501N-D.PDF; ComponentLink3Description: Package Specification; Package Type: SOT-23-3; ComponentLink1Description: Manufacturer URL; PartNumber: NTR4501NT1G; DatasheetVersion: Rev. 13
R1 R3 R4 R6 R7 R9 R10 R12 R13 R15 R16 R18 R19 R21 R22 R24 R25 R27 R28 R30 R31 R33 R34 R36 R37 R39 R40 R42 = CMP-1012-00074-1: as R100 on sheet ConnectorIn; Technology: SMT; Tolerance: 5 %; Power: 0.1 W
R2 R5 R8 R11 R14 R17 R20 R23 R26 R29 R32 R35 R38 R41 = CMP-1012-00026-1: 10R 0.1W 5% 0603 (1608 Metric)  SMD; Case-Metric: 1608; Case-EIA: 0603; Value: 10.00 Ohm; Technology: SMT; Tolerance: 5 %; Power: 0.1 W

## Nets that join several sheets
+5: MCU (7 pins), ConnectorIn (C5.2 S1.1), PowerSupply (5 pins)
+12_HC: ConnectorIn (S1.5), MOSFETs (28 pins)
+12_LC: ConnectorIn (J1.4 J2.1), PowerSupply (C3.2 U3.3)
GND: MCU (10 pins), ConnectorIn (5 pins), ConnectorOut (12 pins), PowerSupply (C3.1 C4.1 LED1.1 U3.1), MOSFETs (28 pins)
CURRENT_SENSE: MCU (U2.12), ConnectorIn (C6.1 R100.1)
MOSFET_A_CTRL: MCU (U2.29), MOSFETs (R2.2)
MOSFET_B_CTRL: MCU (U2.32), MOSFETs (R5.2)
MOSFET_C_CTRL: MCU (U2.1), MOSFETs (R8.2)
MOSFET_D_CTRL: MCU (U2.2), MOSFETs (R11.2)
MOSFET_E_CTRL: MCU (U2.13), MOSFETs (R14.2)
MOSFET_F_CTRL: MCU (U2.14), MOSFETs (R17.2)
MOSFET_G_CTRL: MCU (U2.15), MOSFETs (R20.2)
MOSFET_H_CTRL: MCU (U2.16), MOSFETs (R23.2)
MOSFET_I_CTRL: MCU (U2.23), MOSFETs (R26.2)
MOSFET_K_CTRL: MCU (U2.24 U2.26), MOSFETs (R29.2 R32.2)
MOSFET_L_CTRL: MCU (U2.27), MOSFETs (R35.2)
MOSFET_M_CTRL: MCU (U2.30), MOSFETs (R38.2)
MOSFET_N_CTRL: MCU (U2.3), MOSFETs (R41.2)
NetJ1_2: MCU (U1.6), ConnectorIn (J1.2)
NetJ1_3: MCU (U1.7), ConnectorIn (J1.3)
NetJ4_1: ConnectorOut (J4.1), MOSFETs (Q1.3)
NetJ4_2: ConnectorOut (J4.2), MOSFETs (Q3.3)
NetJ4_3: ConnectorOut (J4.3), MOSFETs (Q5.3)
NetJ4_4: ConnectorOut (J4.4), MOSFETs (Q7.3)
NetJ4_5: ConnectorOut (J4.5), MOSFETs (Q9.3)
NetJ4_6: ConnectorOut (J4.6), MOSFETs (Q11.3)
NetJ4_7: ConnectorOut (J4.7), MOSFETs (Q13.3)
NetJ4_20: ConnectorOut (J4.20), MOSFETs (Q15.3)
NetJ4_21: ConnectorOut (J4.21), MOSFETs (Q17.3)
NetJ4_22: ConnectorOut (J4.22), MOSFETs (Q19.3)
NetJ4_23: ConnectorOut (J4.23), MOSFETs (Q21.3)
NetJ4_24: ConnectorOut (J4.24), MOSFETs (Q23.3)
NetJ4_25: ConnectorOut (J4.25), MOSFETs (Q25.3)
NetJ4_26: ConnectorOut (J4.26), MOSFETs (Q27.3)